# Altium schematic sheet HDMI.SchDoc
size A3; SheetNumber: 17; SheetTotal: 21
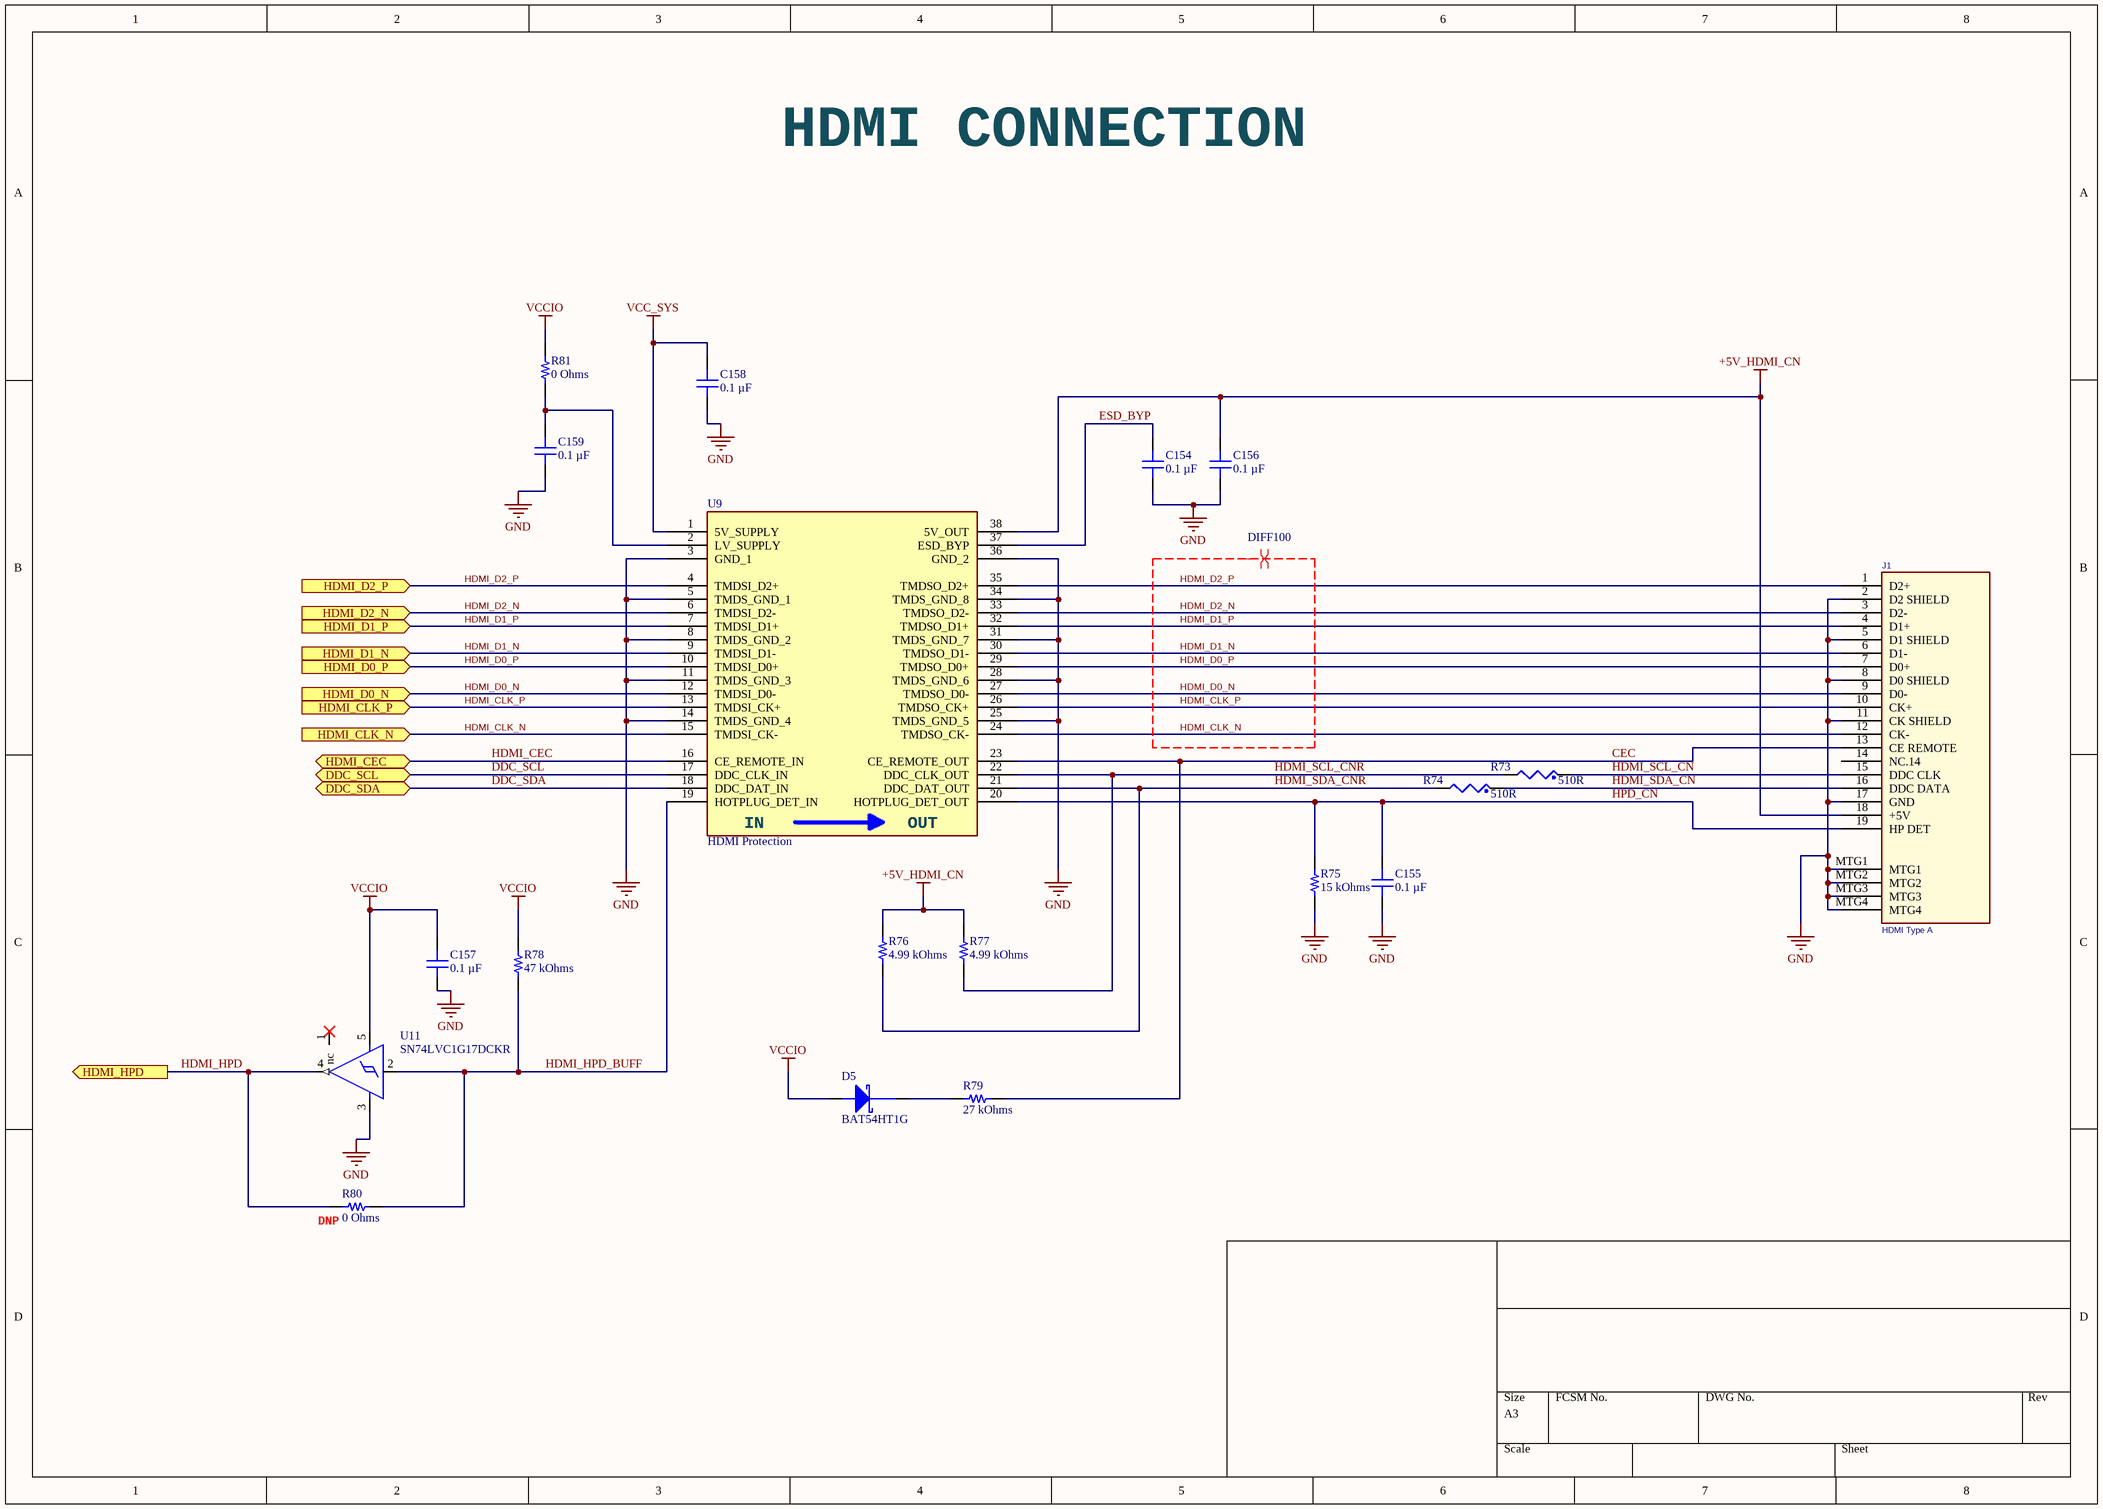
[diagram p0: HDMI.SchDoc]

## Parts
C154  0.1 µF  [CAP 0402_1005]
C155  0.1 µF  [CAP 0402_1005]
C156  0.1 µF  [CAP 0402_1005]
C157  0.1 µF  [CAP 0402_1005]
C158  0.1 µF  [CAP 0402_1005]
C159  0.1 µF  [CAP 0402_1005]
D5  BAT54HT1G  [SOD323]
J1  HDMI Type A  [HDMI Type-A]
R73  510R  [0402_CR]
R74  510R  [0402_CR]
R75  15 kOhms  [RES 0402_1005]
R76  4.99 kOhms  [RES 0402_1005]
R77  4.99 kOhms  [RES 0402_1005]
R78  47 kOhms  [RES 0402_1005]
R79  27 kOhms  [RES 0402_1005]
R80  0 Ohms  [RES 0402_1005]
R81  0 Ohms  [RES 0402_1005]
U9  HDMI Protection  [TSSOP50P640X120-38N]
U11  SN74LVC1G17DCKR  [SC70_5]

## Ports
DDC_SCL (bidir), DDC_SDA (bidir), HDMI_CEC (bidir), HDMI_CLK_N (in), HDMI_CLK_P (in), HDMI_D0_N (in), HDMI_D0_P (in), HDMI_D1_N (in), HDMI_D1_P (in), HDMI_D2_N (in), HDMI_D2_P (in), HDMI_HPD (out)

## Nets
+5V_HDMI_CN: C156.2 J1.18(+5V) R76.2 R77.2 U9.38(5V_OUT)
GND: C154.1 C155.1 C156.1 C157.1 C158.1 C159.1 J1.2(D2_SHIELD) J1.5(D1_SHIELD) J1.8(D0_SHIELD) J1.11(CK_SHIELD) J1.17(GND) J1.MTG1 J1.MTG2 J1.MTG3 J1.MTG4 R75.1 U9.3(GND_1) U9.5(TMDS_GND_1) U9.8(TMDS_GND_2) U9.11(TMDS_GND_3) U9.14(TMDS_GND_4) U9.25(TMDS_GND_5) U9.28(TMDS_GND_6) U9.31(TMDS_GND_7) U9.34(TMDS_GND_8) U9.36(GND_2) U11.3(GND)
VCC_SYS: C158.2 U9.1(5V_SUPPLY)
VCCIO: C157.2 D5.2(Anode) R78.2 R81.2 U11.5(NC1)
CEC: J1.13(CE_REMOTE) R79.2 U9.23(CE_REMOTE_OUT)
DDC_SCL: U9.17(DDC_CLK_IN) ; port DDC_SCL
DDC_SDA: U9.18(DDC_DAT_IN) ; port DDC_SDA
ESD_BYP: C154.2 U9.37(ESD_BYP)
HDMI_CEC: U9.16(CE_REMOTE_IN) ; port HDMI_CEC
HDMI_CLK_N: J1.12(CK-) U9.15(TMDSI_CK-) U9.24(TMDSO_CK-) ; port HDMI_CLK_N
HDMI_CLK_P: J1.10(CK+) U9.13(TMDSI_CK+) U9.26(TMDSO_CK+) ; port HDMI_CLK_P
HDMI_D0_N: J1.9(D0-) U9.12(TMDSI_D0-) U9.27(TMDSO_D0-) ; port HDMI_D0_N
HDMI_D0_P: J1.7(D0+) U9.10(TMDSI_D0+) U9.29(TMDSO_D0+) ; port HDMI_D0_P
HDMI_D1_N: J1.6(D1-) U9.9(TMDSI_D1-) U9.30(TMDSO_D1-) ; port HDMI_D1_N
HDMI_D1_P: J1.4(D1+) U9.7(TMDSI_D1+) U9.32(TMDSO_D1+) ; port HDMI_D1_P
HDMI_D2_N: J1.3(D2-) U9.6(TMDSI_D2-) U9.33(TMDSO_D2-) ; port HDMI_D2_N
HDMI_D2_P: J1.1(D2+) U9.4(TMDSI_D2+) U9.35(TMDSO_D2+) ; port HDMI_D2_P
HDMI_HPD: R80.1 U11.4(O) ; port HDMI_HPD
HDMI_HPD_BUFF: R78.1 R80.2 U9.19(HOTPLUG_DET_IN) U11.2(I)
HDMI_SCL_CN: J1.15(DDC_CLK) R73.1
HDMI_SCL_CNR: R73.2 R77.1 U9.22(DDC_CLK_OUT)
HDMI_SDA_CN: J1.16(DDC_DATA) R74.1
HDMI_SDA_CNR: R74.2 R76.1 U9.21(DDC_DAT_OUT)
HPD_CN: C155.2 J1.19(HP_DET) R75.2 U9.20(HOTPLUG_DET_OUT)
NetC159_2: C159.2 R81.1 U9.2(LV_SUPPLY)
NetD5_1: D5.1(Cathode) R79.1

Not connected (* = marked no-connect by the designer): J1 14(NC.14); U11 1(nc)*

## Layout directives
differential pair; differential pair class DIFF100: HDMI_CLK_N, HDMI_CLK_P, HDMI_D0_N, HDMI_D0_P, HDMI_D1_N, HDMI_D1_P, HDMI_D2_N, HDMI_D2_P

## Notes on the sheet
- HDMI CONNECTION
- (near R80) DNP
- (in symbol CM2020-00TR) IN; OUT

## Library data of the parts
C154-C159 = CC0402ZRY5V6BB104: CAP CER 0.1UF 10V Y5V 0402; manufacturer: Yageo; Temperature Coefficient: Y5V (F); Tolerance: -20%, +80%; Part Number: CC0402ZRY5V6BB104; Value: 0.1 µF; Applications: General Purpose; Capacitance: 0.1 µF; componentlink1description: Datasheet; componentlink1url: http://www.yageo.com/documents/recent/UPY-GPHC_Y5V_6.3V-to-50V_8.pdf; componentlink2description: DigiKey Link; componentlink2url: https://www.digikey.com/en/products/detail/yageo/CC0402ZRY5V6BB104/2833587; Device Package: 0402 (1005 Metric); lastupdated: 2/26/2022 9:02:21 AM; Lifecycle Status: Active; Minimum Order: 1; Mounting Type: Surface Mount, MLCC; Operating Temperature: -30°C ~ 85°C; Package / Case: 0402 (1005 Metric); packaging: CutTape; partid: 10069; Part Status: Active; price: 0.01; series: CC; Size / Dimension: 0.039" L x 0.020" W (1.00mm x 0.50mm); Supplier 1: DigiKey; Supplier Part Number 1: 311-1422-1-ND; Thickness (Max): 0.022" (0.55mm); Voltage - Rated: 10V
D5 = BAT54HT1G: DIODE SCHOTTKY 30V 0.2A SOD323; Manufacturer: Fairchild Semiconductor; Current - Average Rectified (Io): 200mA; Voltage - Forward (Vf) (Max) @ If: 800mV @ 100mA; Speed: Small Signal =< 200mA (Io), Any Speed; Reverse Recovery Time (trr): 5ns; Current - Reverse Leakage @ Vr: 2µA @ 25V; Capacitance @ Vr, F: 10pF @ 1V, 1MHz; Thermal Resistance: 600°C/W Ja; Supplier 1: Digi-Key; Manufacturer Part Number: BAT54HT1G; RoHS: RoHS Compliant; Category: Discrete Semiconductor Products; Stock 1: 11388; Pricing 1: 1=0.3, 10=0.276, 25=0.1984, 100=0.1543, 250=0.09696, 500=0.0826, 1000=0.05628 (USD); Packaging: Cut Tape (CT); Diode Type: Schottky; Voltage - DC Reverse (Vr) (Max): 30V; Mounting Type: Surface Mount; Package / Case: SC-76, SOD-323; Supplier Device Package: SOD-323; Operating Temperature - Junction: -55°C ~ 150°C; ComponentLink1URL: http://www.fairchildsemi.com/ds/BA/BAT54HT1G.pdf; ComponentLink1Description: http://www.fairchildsemi.com/ds/BA/BAT54HT1G.pdf; Supplier Part Number 1: BAT54HT1GCT-ND
J1 = HDMI Type A: CONN RCPT 19POS HDMI RT ANG SMD; Manufacturer: Molex Connector Corporation; Manufacturer Part Number: 47151-0001; .Checked PCB: MM; Number of Positions: 19; Pitch: 0.50mm (.020"); Value: 47151-0001; Gender: Receptacle; .Version: V1.1 - Changed holes to slots; .Checked SCH: MM; Category: Connectors, Interconnects; Connector Type: HDMI; Family: USB, IEEE-1394 (Firewire), DVI, HDMI; Operating Temperature: -20°C to +85°C; Price 1k [$]: 1.74610; Supplier: Digikey; Supplier Part Number: WM19086CT-ND; Supplier 1: Digi-Key; Supplier Part Number 1: WM19086CT-ND; RoHS: RoHS Compliant; Stock 1: 2756; Pricing 1: 1=3.1, 10=2.57, 50=2.1456, 100=1.9034 (USD); Number of Contacts: 19; Specifications: -; Mounting Type: Surface Mount, Right Angle, Horizontal; Features: Detent Lock; Packaging: Cut Tape (CT); Ingress Protection: -; ComponentLink1URL: http://www.molex.com/pdm_docs/sd/471510001_sd.pdf; ComponentLink1Description: http://www.molex.com/pdm_docs/sd/471510001_sd.pdf
R73 R74 = RES: CLASS: DISCRETE
R75 = RMCF0402FT15K0: RES 15K OHM 1% 1/16W 0402; Manufacturer: Stackpole Electronics Inc; Power (Watts): 0.063W, 1/16W; Temperature Coefficient: ±100ppm/°C; Part Number: RMCF0402FT15K0; Value: 15 kOhms; ComponentLink1Description: Datasheet; ComponentLink1URL: https://www.seielect.com/catalog/sei-rmcf_rmcp.pdf; ComponentLink2Description: DigiKey Link; ComponentLink2URL: https://www.digikey.com/en/products/detail/stackpole-electronics-inc/RMCF0402FT15K0/1761817; Composition: Thick Film; Device Package: 0402 (1005 Metric); Features: Automotive AEC-Q200; Height - Seated (Max): 0.016" (0.40mm); LastUpdated: 2/26/2022 8:42:09 AM; Lifecycle Status: Active; Minimum Order: 1; Number of Terminations: 2; Operating Temperature: -55°C ~ 155°C; Package / Case: 0402 (1005 Metric); Packaging: CutTape; PartId: 5006; Part Status: Active; Price: 0.01; Ratings: AEC-Q200; Resistance: 15 kOhms; Series: RMCF; Size / Dimension: 0.039" L x 0.020" W (1.00mm x 0.50mm); Supplier 1: DigiKey; Supplier Part Number 1: RMCF0402FT15K0CT-ND; Supplier Device Package: 0402; Tolerance: ±1%
R76 R77 = RN73C1E4K99BTD: RES SMD 4.99KOHM 0.1% 1/16W 0402; Manufacturer: TE Connectivity Passive Product; Power (Watts): 0.063W, 1/16W; Temperature Coefficient: ±10ppm/°C; Part Number: RN73C1E4K99BTD; Value: 4.99 kOhms; ComponentLink1Description: Datasheet; ComponentLink1URL: https://www.te.com/commerce/DocumentDelivery/DDEController?Action=srchrtrv&DocNm=1773270&DocType=DS&DocLang=English; ComponentLink2Description: DigiKey Link; ComponentLink2URL: http://digikey.com/product-detail/en/te-connectivity-passive-product/RN73C1E4K99BTD/A121705CT-ND/5248063; Composition: Thin Film; Device Package: 0402 (1005 Metric); Height - Seated (Max): 0.014" (0.35mm); LastUpdated: 2/26/2022 8:42:16 AM; Lifecycle Status: Active; Minimum Order: 1; Number of Terminations: 2; Operating Temperature: -55°C ~ 155°C; Package / Case: 0402 (1005 Metric); Packaging: TapeAndReel; PartId: 2964; Part Status: Active; Price: 0.26; Resistance: 4.99 kOhms; Series: RN73, Holsworthy; Size / Dimension: 0.039" L x 0.020" W (1.00mm x 0.50mm); Supplier 1: DigiKey; Supplier Part Number 1: A121705CT-ND; Supplier Device Package: 0402; Tolerance: ±0.1%
R78 = AC0402JR-0747KL: RES SMD 47K OHM 5% 1/16W 0402; Manufacturer: Yageo; Power (Watts): 0.063W, 1/16W; Temperature Coefficient: ±100ppm/°C; Part Number: AC0402JR-0747KL; Value: 47 kOhms; ComponentLink1Description: Datasheet; ComponentLink1URL: https://www.yageo.com/upload/media/product/productsearch/datasheet/rchip/PYu-AC_51_RoHS_L_7.pdf; ComponentLink2Description: DigiKey Link; ComponentLink2URL: https://www.digikey.com/en/products/detail/yageo/AC0402JR-0747KL/5895679; Composition: Thick Film; Device Package: 0402 (1005 Metric); Features: Automotive AEC-Q200, Moisture Resistant; Height - Seated (Max): 0.015" (0.37mm); LastUpdated: 2/26/2022 8:42:14 AM; Lifecycle Status: Active; Minimum Order: 1; Number of Terminations: 2; Operating Temperature: -55°C ~ 155°C; Package / Case: 0402 (1005 Metric); Packaging: CutTape; PartId: 3385; Part Status: Active; Price: 0.01; Ratings: AEC-Q200; Resistance: 47 kOhms; Series: AC; Size / Dimension: 0.039" L x 0.020" W (1.00mm x 0.50mm); Supplier 1: DigiKey; Supplier Part Number 1: YAG3547CT-ND; Supplier Device Package: 0402; Tolerance: ±5%
R79 = RC0402JR-0727KL: RES 27K OHM 5% 1/16W 0402; Manufacturer: Yageo; Power (Watts): 0.063W, 1/16W; Temperature Coefficient: ±100ppm/°C; Part Number: RC0402JR-0727KL; Value: 27 kOhms; ComponentLink1Description: Datasheet; ComponentLink1URL: https://www.yageo.com/upload/media/product/productsearch/datasheet/rchip/PYu-RC_Group_51_RoHS_L_10.pdf; ComponentLink2Description: DigiKey Link; ComponentLink2URL: https://www.digikey.com/en/products/detail/yageo/RC0402JR-0727KL/726451; Composition: Thick Film; Device Package: 0402 (1005 Metric); Features: Moisture Resistant; Height - Seated (Max): 0.016" (0.40mm); LastUpdated: 2/26/2022 8:42:09 AM; Lifecycle Status: Active; Minimum Order: 1; Number of Terminations: 2; Operating Temperature: -55°C ~ 155°C; Package / Case: 0402 (1005 Metric); Packaging: CutTape; PartId: 4832; Part Status: Active; Price: 0.01; Resistance: 27 kOhms; Series: RC_L; Size / Dimension: 0.039" L x 0.020" W (1.00mm x 0.50mm); Supplier 1: DigiKey; Supplier Part Number 1: 311-27KJRCT-ND; Supplier Device Package: 0402; Tolerance: ±5%
R80 R81 = CR0402AJ/-000GAS: RESA-AS 0402 0R JUMPER 63MW; Manufacturer: Bourns Inc.; Power (Watts): 0.063W, 1/16W; Part Number: CR0402AJ/-000GAS; Value: 0 Ohms; ComponentLink1Description: Datasheet; ComponentLink1URL: //media.digikey.com/pdf/Data%20Sheets/Bourns%20PDFs/CRyyyyA-AS_Model_DS.pdf; ComponentLink2Description: DigiKey Link; ComponentLink2URL: https://www.digikey.com/en/products/detail/bourns-inc/CR0402AJ-000GAS/10240110; Composition: Thick Film; Device Package: 0402 (1005 Metric); Features: Anti-Sulfur, Automotive AEC-Q200, Moisture Resistant; Height - Seated (Max): 0.015" (0.37mm); LastUpdated: 2/26/2022 8:42:02 AM; Lifecycle Status: Active; Minimum Order: 1; Number of Terminations: 2; Operating Temperature: -55°C ~ 155°C; Package / Case: 0402 (1005 Metric); Packaging: CutTape; PartId: 7106; Part Status: Active; Price: 0.01; Ratings: AEC-Q200; Resistance: 0 Ohms; Series: CR0402A-AS; Size / Dimension: 0.039" L x 0.020" W (1.00mm x 0.50mm); Supplier 1: DigiKey; Supplier Part Number 1: CR0402AJ/-000GASCT-ND; Supplier Device Package: 0402; Tolerance: Jumper
U9 = CM2020-00TR: HDMI Transmitter Port / Protection and Interface / Device 38-TSSOP; Mfr: ON Semiconductor; Value: *; Availability: Unavailable; Price: None; Mfr_Part_No: CM2020-00TR; Package: TSSOP-38 ON Semiconductor; Creator: Arman_Arvand
U11 = SN74LVC1G17DCKR: IC BUFFER SCHMIT TRIG SC705; Manufacturer: Texas Instruments; Logic Type: Schmitt Trigger - Buffer, Driver; Number of Elements: 1; Current - Output High, Low: 32mA, 32mA; Voltage - Supply: 1.65 V ~ 5.5 V; .Checked PCB: RF; Supplier 1: Digi-Key; Supplier Part Number 1: 296-11934-1-ND; Manufacturer Part Number: SN74LVC1G17DCKR; RoHS: RoHS Compliant; Category: Integrated Circuits (ICs); Stock 1: 50549; Pricing 1: 1=0.12, 10=0.097, 25=0.086, 100=0.0581, 250=0.05696, 500=0.0559, 750=0.05483 (USD); Number of Bits per Element: 1; Operating Temperature: -40°C ~ 85°C; Mounting Type: Surface Mount; Package / Case: 6-TSSOP (5 Lead), SC-88A, SOT-353; Supplier Device Package: SC-70-5; Packaging: Cut Tape (CT); ComponentLink1URL: http://www.ti.com/lit/ds/symlink/sn74lvc1g17.pdf; ComponentLink1Description: http://www.ti.com/lit/ds/symlink/sn74lvc1g17.pdf; .Checked SCH: RF